# EAGLE design MUTE-basic (EAGLE 9.6.0)
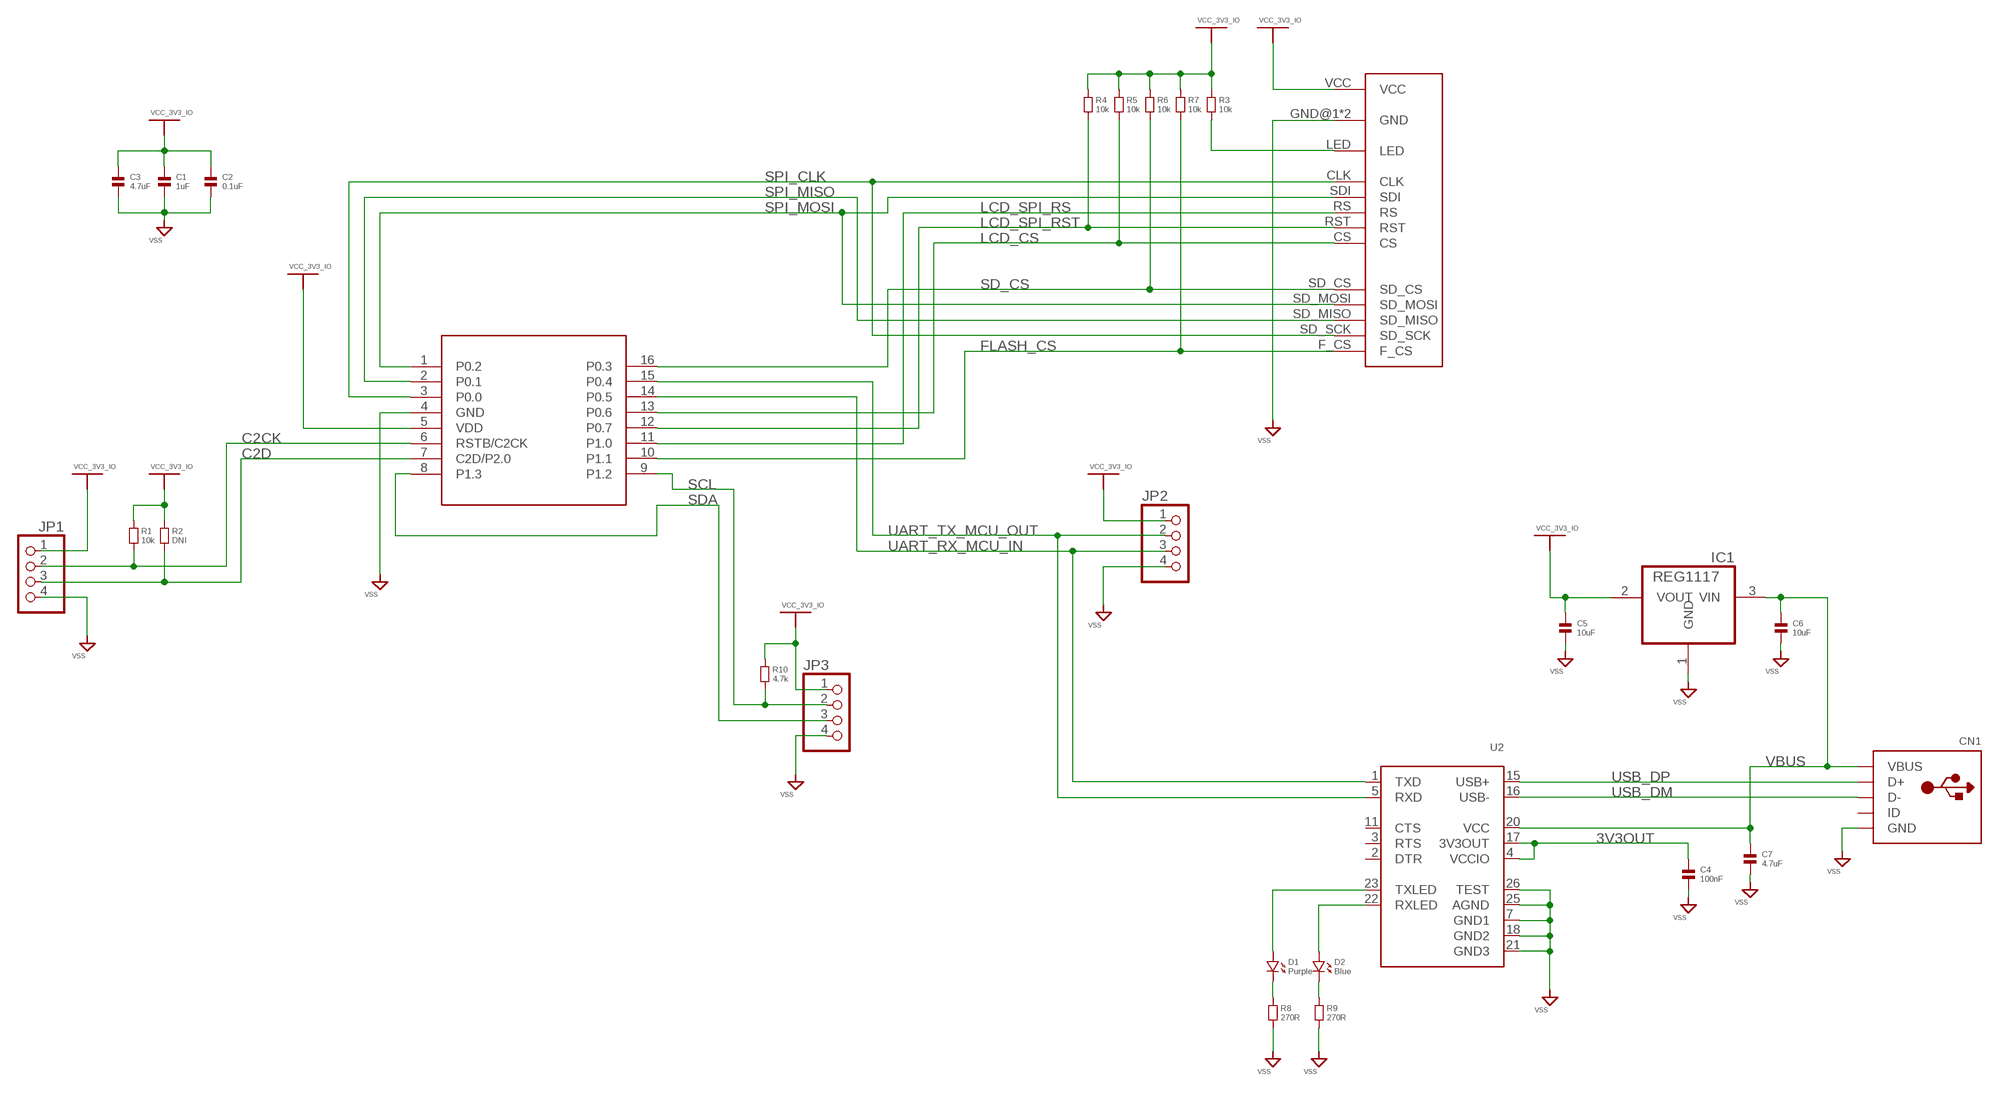
[diagram p0: schematic, sheet 1]

## Parts
C1  1uF  CAPACITOR.0603  [0603]
C2  0.1uF  CAPACITOR.0603  [0603]
C3  4.7uF  CAPACITOR.0603  [0603]
C4  100nF  CAPACITOR.0603  [0603]
C5  10uF  CAPACITOR.0603  [0603]
C6  10uF  CAPACITOR.0603  [0603]
C7  4.7uF  CAPACITOR.0603  [0603]
CN1  USBMINIB  [USB-MINIB]
D1  Purple  LED.0603  [0603.LED]
D2  Blue  LED.0603  [0603.LED]
IC1  REG1117  [SOT223]
JP1  PINHD-1X4  [1X04]
JP2  PINHD-1X4  [1X04]
JP3  PINHD-1X4  [1X04]
R1  10k  RESISTOR.0603  [0603]
R2  DNI  RESISTOR.0603  [0603]
R3  10k  RESISTOR.0603  [0603]
R4  10k  RESISTOR.0603  [0603]
R5  10k  RESISTOR.0603  [0603]
R6  10k  RESISTOR.0603  [0603]
R7  10k  RESISTOR.0603  [0603]
R8  270R  RESISTOR.0603  [0603]
R9  270R  RESISTOR.0603  [0603]
R10  4.7k  RESISTOR.0603  [0603]
U1  SILICON_LABS-MICROCONTROLLER-EFM8BB10F8G-SOIC16  [SILICON_LABS-MICROCONTROLLER-EFM8BB10F8G-A-SOIC16]
U2  FT232RLSSOP28  [SSOP28DB]
U$1  WINGONEER_ILI9225  [WINGONEER_ILI9225]

## Nets
3V3OUT: C4.1 U2.4(VCCIO) U2.17(3V3OUT)
C2CK: JP1.2 R1.2 U1.6(RSTB/C2CK)
C2D: JP1.3 R2.2 U1.7(C2D/P2.0)
FLASH_CS: R7.2 U1.10(P1.1) U$1.F_CS
LCD_CS: R5.2 U1.13(P0.6) U$1.CS
LCD_SPI_RS: U1.11(P1.0) U$1.RS
LCD_SPI_RST: R4.2 U1.12(P0.7) U$1.RST
N$2: R3.2 U$1.LED
N$6: D1.P$1 U2.23(TXLED)
N$7: D2.P$1 U2.22(RXLED)
N$8: D2.P$2 R9.1
N$9: D1.P$2 R8.1
SCL: JP3.2 R10.2 U1.9(P1.2)
SD_CS: R6.2 U1.16(P0.3) U$1.SD_CS
SDA: JP3.3 U1.8(P1.3)
SPI_CLK: U1.3(P0.0) U$1.CLK U$1.SD_SCK
SPI_MISO: U1.2(P0.1) U$1.SD_MISO
SPI_MOSI: U1.1(P0.2) U$1.SD_MOSI U$1.SDI
UART_RX_MCU_IN: JP2.3 U1.14(P0.5) U2.1(TXD)
UART_TX_MCU_OUT: JP2.2 U1.15(P0.4) U2.5(RXD)
USB_DM: CN1.D- U2.16(USB-)
USB_DP: CN1.D+ U2.15(USB+)
VBUS: C6.1 C7.1 CN1.VBUS IC1.3(VIN) U2.20(VCC)
VCC_3V3_IO: C1.1 C2.1 C3.1 C5.1 IC1.2(VOUT) JP1.1 JP2.1 JP3.1 R1.1 R2.1 R3.1 R4.1 R5.1 R6.1 R7.1 R10.1 U1.5(VDD) U$1.VCC
VSS: C1.2 C2.2 C3.2 C4.2 C5.2 C6.2 C7.2 CN1.GND IC1.1(GND) JP1.4 JP2.4 JP3.4 R8.2 R9.2 U1.4(GND) U2.7(GND1) U2.18(GND2) U2.21(GND3) U2.25(AGND) U2.26(TEST) U$1.GND@1(GND) U$1.GND@2(GND)
Unconnected: CN1.ID U2.2(DTR) U2.3(RTS) U2.11(CTS)

## Library data of the parts
C1-C7 = standardparts:CAPACITOR
CN1 = adafruit:USB: USB Connectors USBMINIB - Surface Mount Female Mini-B USB Connector 4UConnector: 06564 By microbuilder.eu Thru-hole RA Female Mini-B USB Connector 4UConnector: 18732 By ladyada.net
D1 D2 = standardparts:LED
IC1 = burr-brown:REG1117: 800mA and 1A Low Dropout (LDO) Positive Regulator 1.8V, 2.5V, 2.85V, 3.3V, 5V, and Adj; MPN: REG1117; OC_FARNELL: 1097566; OC_NEWARK: 14P6981
JP1-JP3 = pinhead:PINHD-1X4: PIN HEADER
R1-R10 = standardparts:RESISTOR
U1 = Module_ICs:SILICON_LABS-MICROCONTROLLER-EFM8BB10F8G-SOIC16
U2 = microbuilder:FT232RL: FTDI FT232RL USB TO RS232 Converter Digikey: 768-1007-1-ND
U$1 = PocketPC_Screens:WINGONEER_ILI9225

## Board
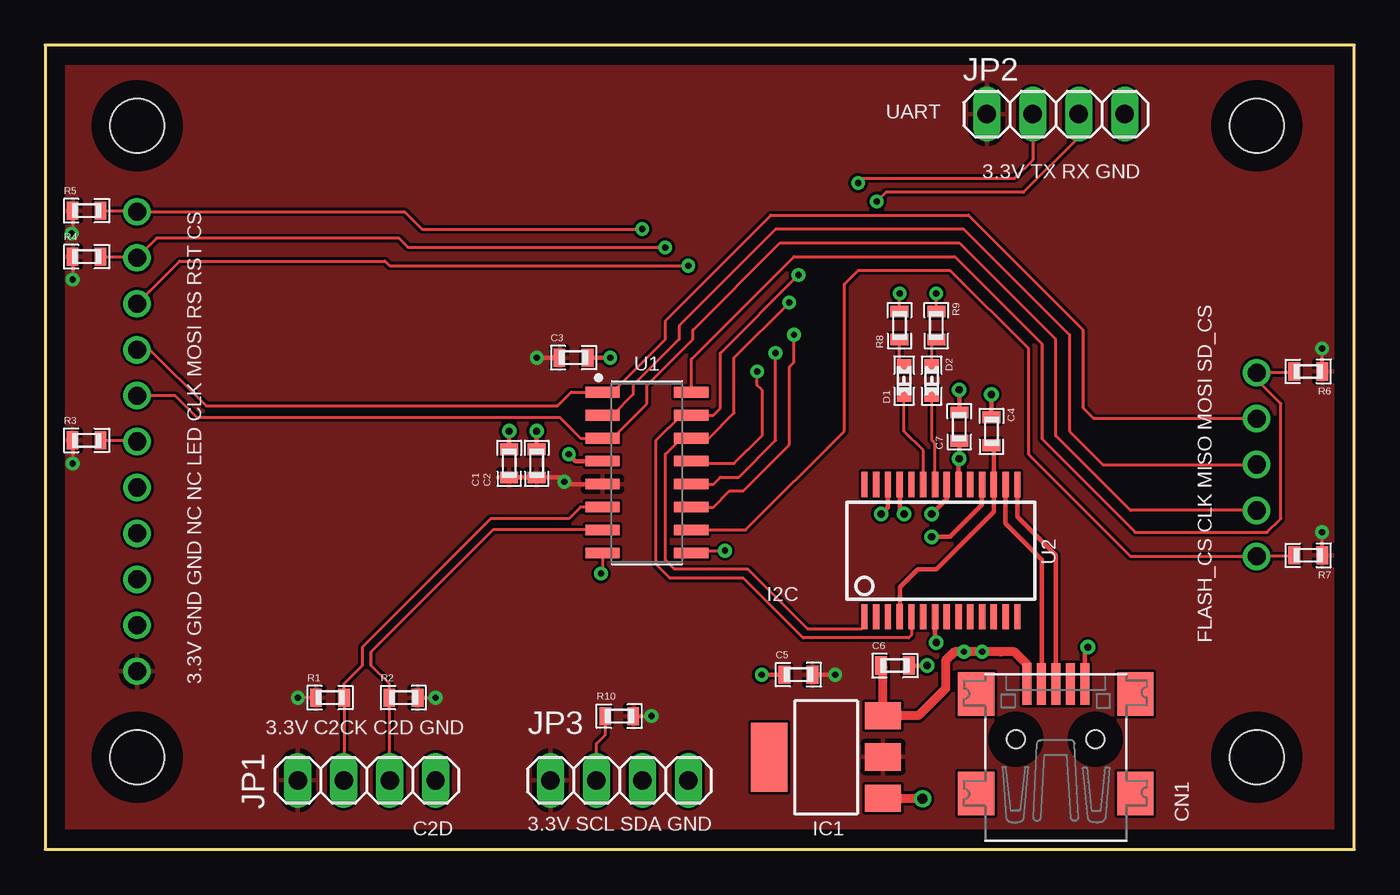
[diagram p1: board, top side]
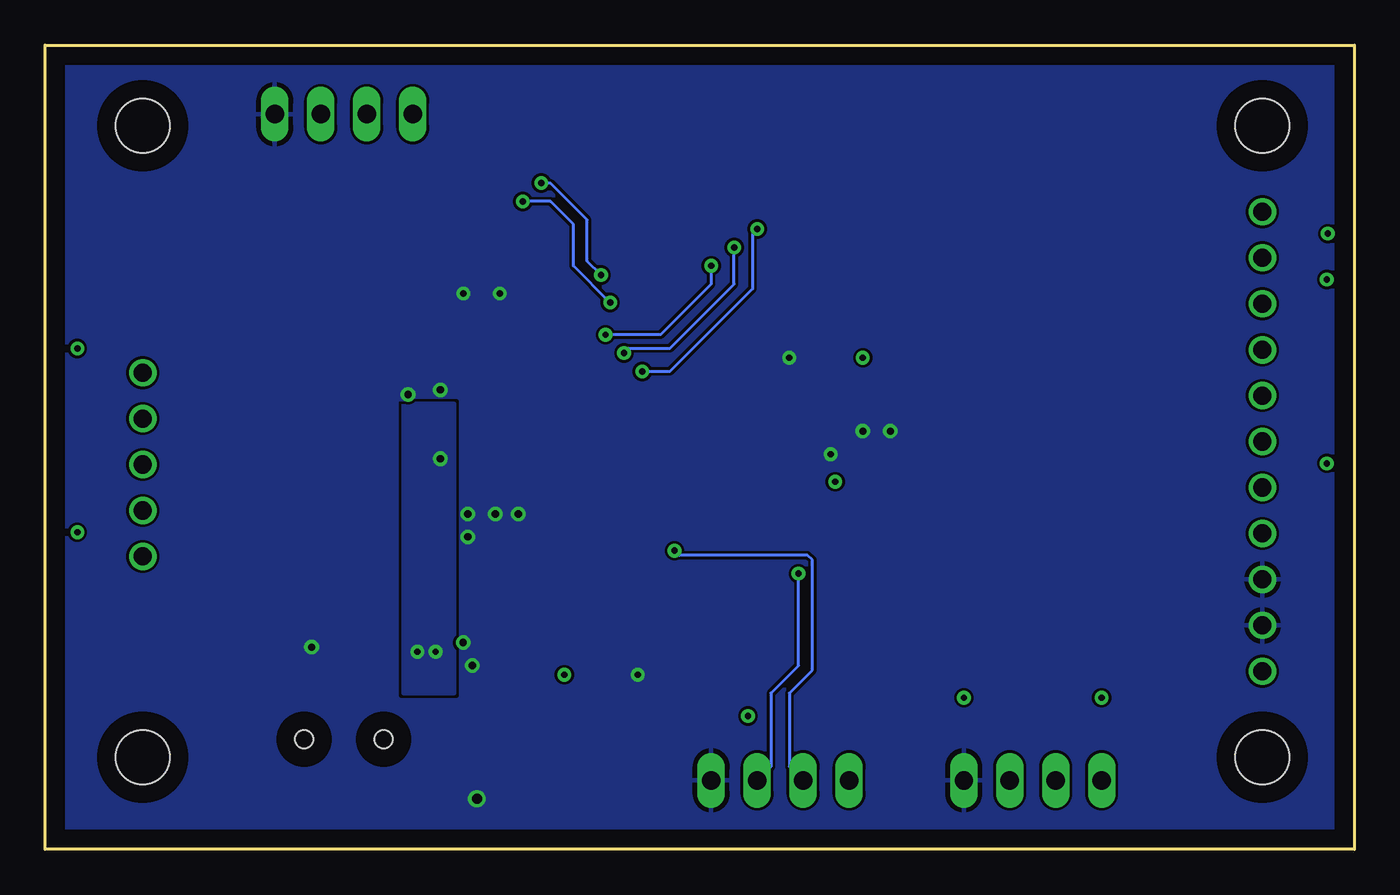
[diagram p2: board, bottom side, seen from below]

Size 72.39 x 44.45 mm. Coordinates in mm from the lower left corner, seen from the top.
Outline: 0,44.45 0,0 72.39,0 72.39,44.45 0,44.45
Copper layers (1*16): Top 0.035mm / dielectric 1.5mm / Bottom 0.035mm
Design rules "default": minimum track width 6mil, minimum drill 0.35mm, track to track 6mil, track to pad 6mil, pad to pad 6mil, via to via 6mil, smd to smd 6mil, copper to edge 40mil, drill to drill 6mil, minimum pad ring 10mil, minimum via ring 8mil, stop-mask expansion 4mil, vias tented up to drill 0mil, thermal gap 10mil

### Footprints (pad centres in the part's own frame; a part is rotated, then mirrored left to right if it is on the bottom)
0603 = smd 0.65 x 1: 1 -0.775,0; 2 0.775,0
USB-MINIB = smd 0.5 x 2.308: D+ 0,4.064; D- -0.8,4.064; GND 1.6,4.064; ID 0.8,4.064; VBUS -1.6,4.064 | smd 2 x 2.4: GND1 -4.4,-2; GND2 -4.4,3.5; GND3 4.4,3.5; GND4 4.4,-2 | hole 1: -2.2,1; 2.2,1
0603.LED = smd 0.8 x 0.8: P$1 -0.775,0; P$2 0.775,0
SOT223 = smd 1.499 x 2.007: 1 -2.261,-3.15; 2 0.025,-3.15; 3 2.311,-3.15 | smd 3.81 x 2.007: 4 0,3.15
1X04 = drill 1.016 long: 1 -3.81,0; 2 -1.27,0; 3 1.27,0; 4 3.81,0
SILICON_LABS-MICROCONTROLLER-EFM8BB10F8G-A-SOIC16 = smd 1.901 x 0.599: 1 -2.455,4.445; 2 -2.455,3.175; 3 -2.455,1.905; 4 -2.455,0.635; 5 -2.455,-0.635; 6 -2.455,-1.905; 7 -2.455,-3.175; 8 -2.455,-4.445; 9 2.455,-4.445; 10 2.455,-3.175; 11 2.455,-1.905; 12 2.455,-0.635; 13 2.455,0.635; 14 2.455,1.905; 15 2.455,3.175; 16 2.455,4.445
SSOP28DB = smd 0.348 x 1.397: 1 -4.225,-3.656; 2 -3.575,-3.656; 3 -2.925,-3.656; 4 -2.275,-3.656; 5 -1.625,-3.656; 6 -0.975,-3.656; 7 -0.325,-3.656; 8 0.325,-3.656; 9 0.975,-3.656; 10 1.625,-3.656; 11 2.275,-3.656; 12 2.925,-3.656; 13 3.575,-3.656; 14 4.225,-3.656; 15 4.225,3.656; 16 3.575,3.656; 17 2.925,3.656; 18 2.275,3.656; 19 1.625,3.656; 20 0.975,3.656; 21 0.325,3.656; 22 -0.325,3.656; 23 -0.975,3.656; 24 -1.625,3.656; 25 -2.275,3.656; 26 -2.925,3.656; 27 -3.575,3.656; 28 -4.225,3.656
WINGONEER_ILI9225 = drill 1: CLK 0,20.003; CS 0,30.163; F_CS 61.913,11.113; GND@1 0,9.842; GND@2 0,7.303; LED 0,17.462; NC@1 0,14.922; NC@2 0,12.383; RS 0,25.082; RST 0,27.622; SD_CS 61.913,21.26; SD_MISO 61.913,16.192; SD_MOSI 61.913,18.733; SD_SCK 61.913,13.652; SDI 0,22.53; VCC 0,4.763 | hole 3: 0,0; 0,34.925; 61.913,0; 61.913,34.925

### Placement (x,y rotation side)
C1  25.65,21.34 90 top
C2  27.18,21.34 90 top
C3  29.21,27.18 0 top
C4  52.32,23.11 90 top
C5  41.66,9.65 180 top
C6  46.99,10.16 0 top
C7  50.55,23.37 90 top
CN1  55.88,5.08 0 top
D1  47.5,25.91 90 top
D2  49.02,25.91 90 top
IC1  43.18,5.08 90 top
JP1  17.78,3.81 0 top
JP2  55.88,40.64 0 top
JP3  31.75,3.81 0 top
R1  15.75,8.38 0 top
R2  19.81,8.38 180 top
R3  2.29,22.61 0 top
R4  2.29,32.77 0 top
R5  2.29,35.31 0 top
R6  69.85,26.42 180 top
R7  69.85,16.26 180 top
R8  47.24,28.96 90 top
R9  49.28,28.96 90 top
R10  31.75,7.37 180 top
U1  33.27,20.83 0 top
U2  49.53,16.51 0 top
U$1  5.08,5.08 0 top

### Tracks (layer width: path | path; a pad name or v marks a point on that pad's centre or on a via)
3V3OUT
  Top 0.254: C4.1 52.45,22.21 U2.17 52.45,18.67 49.28,15.49 48.26,15.49 47.25,14.49 U2.4
C2CK
  Top 0.152: JP1.2 16.52,3.82 R1.2 16.52,9.16 17.53,10.16 17.53,11.18 24.64,18.29 28.96,18.29 29.59,18.92 U1.6
C2D
  Top 0.152: JP1.3 19.05,8.37 R2.2 19.04,9.16 18.03,10.16 18.03,10.92 24.77,17.65 U1.7
FLASH_CS
  Top 0.152: R7.2 69.01,16.19 U$1.F_CS 60.01,16.19 54.36,21.84 54.36,27.69 50.04,32 44.96,32 44.2,31.24 44.2,23.11 38.73,17.65 U1.10
LCD_CS  (via drill 0.35)
  Top 0.152: R5.2 5.02,35.31 U$1.CS 19.88,35.24 20.83,34.29 v33.02,34.29 | U1.13 35.86,21.34 38.1,21.34 39.62,22.86 39.62,25.4 39.37,25.65 v39.37,26.42
  Bottom 0.152: v39.37,26.42 37.85,26.42 33.27,30.99 33.27,34.04 v33.02,34.29
LCD_SPI_RS  (via drill 0.35)
  Top 0.152: U$1.RS 7.43,32.51 18.8,32.51 19.05,32.26 v35.56,32.26 | U1.11 36.96,18.92 37.85,19.81 38.61,19.81 41.15,22.35 41.15,26.67 41.4,26.92 v41.4,28.45
  Bottom 0.152: v35.56,32.26 35.56,31.24 38.35,28.45 v41.4,28.45
LCD_SPI_RST  (via drill 0.35)
  Top 0.152: R4.2 5.02,32.77 U$1.RST 6.16,33.78 19.56,33.78 20.07,33.27 v34.29,33.27 | U1.12 36.96,20.19 37.34,20.57 38.35,20.57 40.39,22.61 v40.39,27.43
  Bottom 0.152: v40.39,27.43 40.13,27.69 37.85,27.69 34.29,31.24 v34.29,33.27
N$2
  Top 0.152: R3.2 5.02,22.61 U$1.LED
N$6
  Top 0.152: U2.23 48.55,22.06 47.5,23.11 D1.P$1
N$7
  Top 0.152: U2.22 49.2,22.42 49.02,22.61 D2.P$1
N$8
  Top 0.152: D2.P$2 49.02,27.93 R9.1
N$9
  Top 0.152: D1.P$2 47.24,26.94 R8.1
SCL  (via drill 0.35)
  Top 0.152: U1.9 35.86,16.51 v37.59,16.51 | JP3.2 30.48,5.84 30.98,6.34 R10.2
  Bottom 0.152: JP3.2 31.24,4.57 31.24,8.64 29.97,9.91 29.97,16 30.23,16.26 37.34,16.26 v37.59,16.51
SD_CS
  Top 0.152: R6.2 69,26.34 U$1.SD_CS 66.99,25.97 68.33,24.64 68.33,18.29 67.56,17.53 60.27,17.53 55.12,22.68 55.12,27.94 50.29,32.77 41.4,32.77 35.73,27.09 U1.16
SDA  (via drill 0.35)
  Top 0.152: U1.8 30.82,15.32 v30.73,15.24
  Bottom 0.152: JP3.3 32.26,4.57 32.26,8.64 30.73,10.16 v30.73,15.24
SPI_CLK
  Top 0.152: U$1.CLK 7.18,25.08 8.38,23.88 28.45,23.88 29.59,22.73 U1.3 31.37,22.73 33.27,24.64 33.27,25.65 35.81,28.19 35.81,28.7 40.64,33.53 50.55,33.53 55.88,28.19 55.88,22.86 60.01,18.73 U$1.SD_SCK
SPI_MISO
  Top 0.152: U$1.SD_MISO 58.48,21.27 56.64,23.11 56.64,28.45 50.8,34.29 40.39,34.29 35.05,28.96 35.05,28.19 32.51,25.65 32.51,25.15 31.37,24 U1.2
SPI_MOSI
  Top 0.152: U$1.SDI 5.79,27.61 8.89,24.51 28.32,24.51 29.08,25.27 U1.1 31.37,25.27 34.29,28.19 34.29,29.21 40.13,35.05 51.05,35.05 57.4,28.7 57.4,24.38 57.98,23.81 U$1.SD_MOSI
UART_RX_MCU_IN  (via drill 0.35)
  Top 0.152: U2.1 45.3,12.35 45.15,12.19 42.16,12.19 38.86,15.49 34.8,15.49 34.29,16 34.29,21.84 35.18,22.73 U1.14 36.7,22.73 38.1,24.13 38.1,27.18 v41.15,30.23 | JP2.3 57.15,39.37 54.1,36.32 46.48,36.32 v45.97,35.81
  Bottom 0.152: v45.97,35.81 44.45,35.81 43.18,34.54 43.18,32.26 v41.15,30.23
UART_TX_MCU_OUT  (via drill 0.35)
  Top 0.152: U2.5 47.91,11.84 47.75,11.68 41.91,11.68 38.61,14.99 34.54,14.99 33.78,15.75 33.78,22.61 35.18,24 U1.15 36.96,24 37.34,24.38 37.34,27.43 v41.66,31.75 | JP2.2 54.61,38.1 53.59,37.08 45.21,37.08 v44.96,36.83
  Bottom 0.152: v41.66,31.75 42.42,32.51 42.42,34.8 44.45,36.83 v44.96,36.83
USB_DM
  Top 0.254: CN1.D- 55.12,9.18 55.12,16 53.1,18.02 U2.16
USB_DP
  Top 0.254: CN1.D+ 55.88,16.26 53.75,18.38 U2.15
VBUS  (via drill 0.35, 0.4)
  Top 0.254: U2.20 50.5,21.55 v50.55,21.59 C7.1
  Top 0.508: C6.1 46.33,10.04 IC1.3 48.28,7.39 49.78,8.89 49.78,10.41 50.29,10.92 v50.8,10.92 v51.82,10.92 52.83,10.92 53.59,10.92 54.28,10.24 CN1.VBUS
  pour Bottom: 49.78,24.64 49.78,8.64 52.58,8.64 52.58,24.64
VCC_3V3_IO  (via drill 0.35)
  Top 0.152: R1.1 v13.97,8.38 | R2.1 v21.59,8.38 | R7.1 70.61,16.27 v70.61,17.53 | R6.1 70.61,26.43 v70.61,27.69 | R3.1 v1.51,21.35 v1.52,21.34 | R4.1 v1.51,31.51 v1.52,31.5 | R5.1 1.51,34.08 v1.47,34.04 | R10.1 v33.53,7.37
  Top 0.254: C1.1 C2.1 28.46,20.56 v28.7,20.32 28.83,20.19 U1.5 | C3.1 v27.18,27.18 | C5.1 v43.69,9.65
  pour Top: 0,0 72.39,0 72.39,44.45 0.25,44.45 0,44.45
VSS  (via drill 0.35, 0.4, 0.55)
  Top 0.152: R9.2 v49.28,30.73 | R8.2 v47.24,30.73
  Top 0.254: CN1.GND 57.48,11 v57.66,11.18 | U2.7 49.2,11.5 v49.28,11.43 | C6.2 v48.77,10.16 | C7.2 v50.55,25.4 | C4.2 v52.32,25.15 | U2.21 49.85,19.38 v49.02,18.54 | U2.18 51.8,19.04 50.04,17.27 v49.02,17.27 | v47.5,18.54 47.25,18.79 U2.25 | U2.26 46.6,18.92 v46.23,18.54 | C2.2 v27.18,23.11 | C1.2 v25.65,23.11 | C3.2 v31.24,27.18 | C5.2 v39.62,9.65 | U1.4 29.34,21.46 v28.96,21.84
  Top 0.508: IC1.1 48.49,2.82 v48.51,2.79
  pour Bottom (rank 2): 72.39,0 0,0 0,44.45 72.39,44.45

### Text on the board
tPlace: UART | 3.3V TX RX GND | I2C | FLASH_CS CLK MISO MOSI SD_CS | 3.3V GND GND NC NC LED CLK MOSI RS RST CS | 3.3V C2CK C2D GND | C2D | 3.3V SCL SDA GND